# EAGLE schematic LandingGearSchematic_2 (EAGLE 9.5.1)

## Sheet 1 of 4: Title
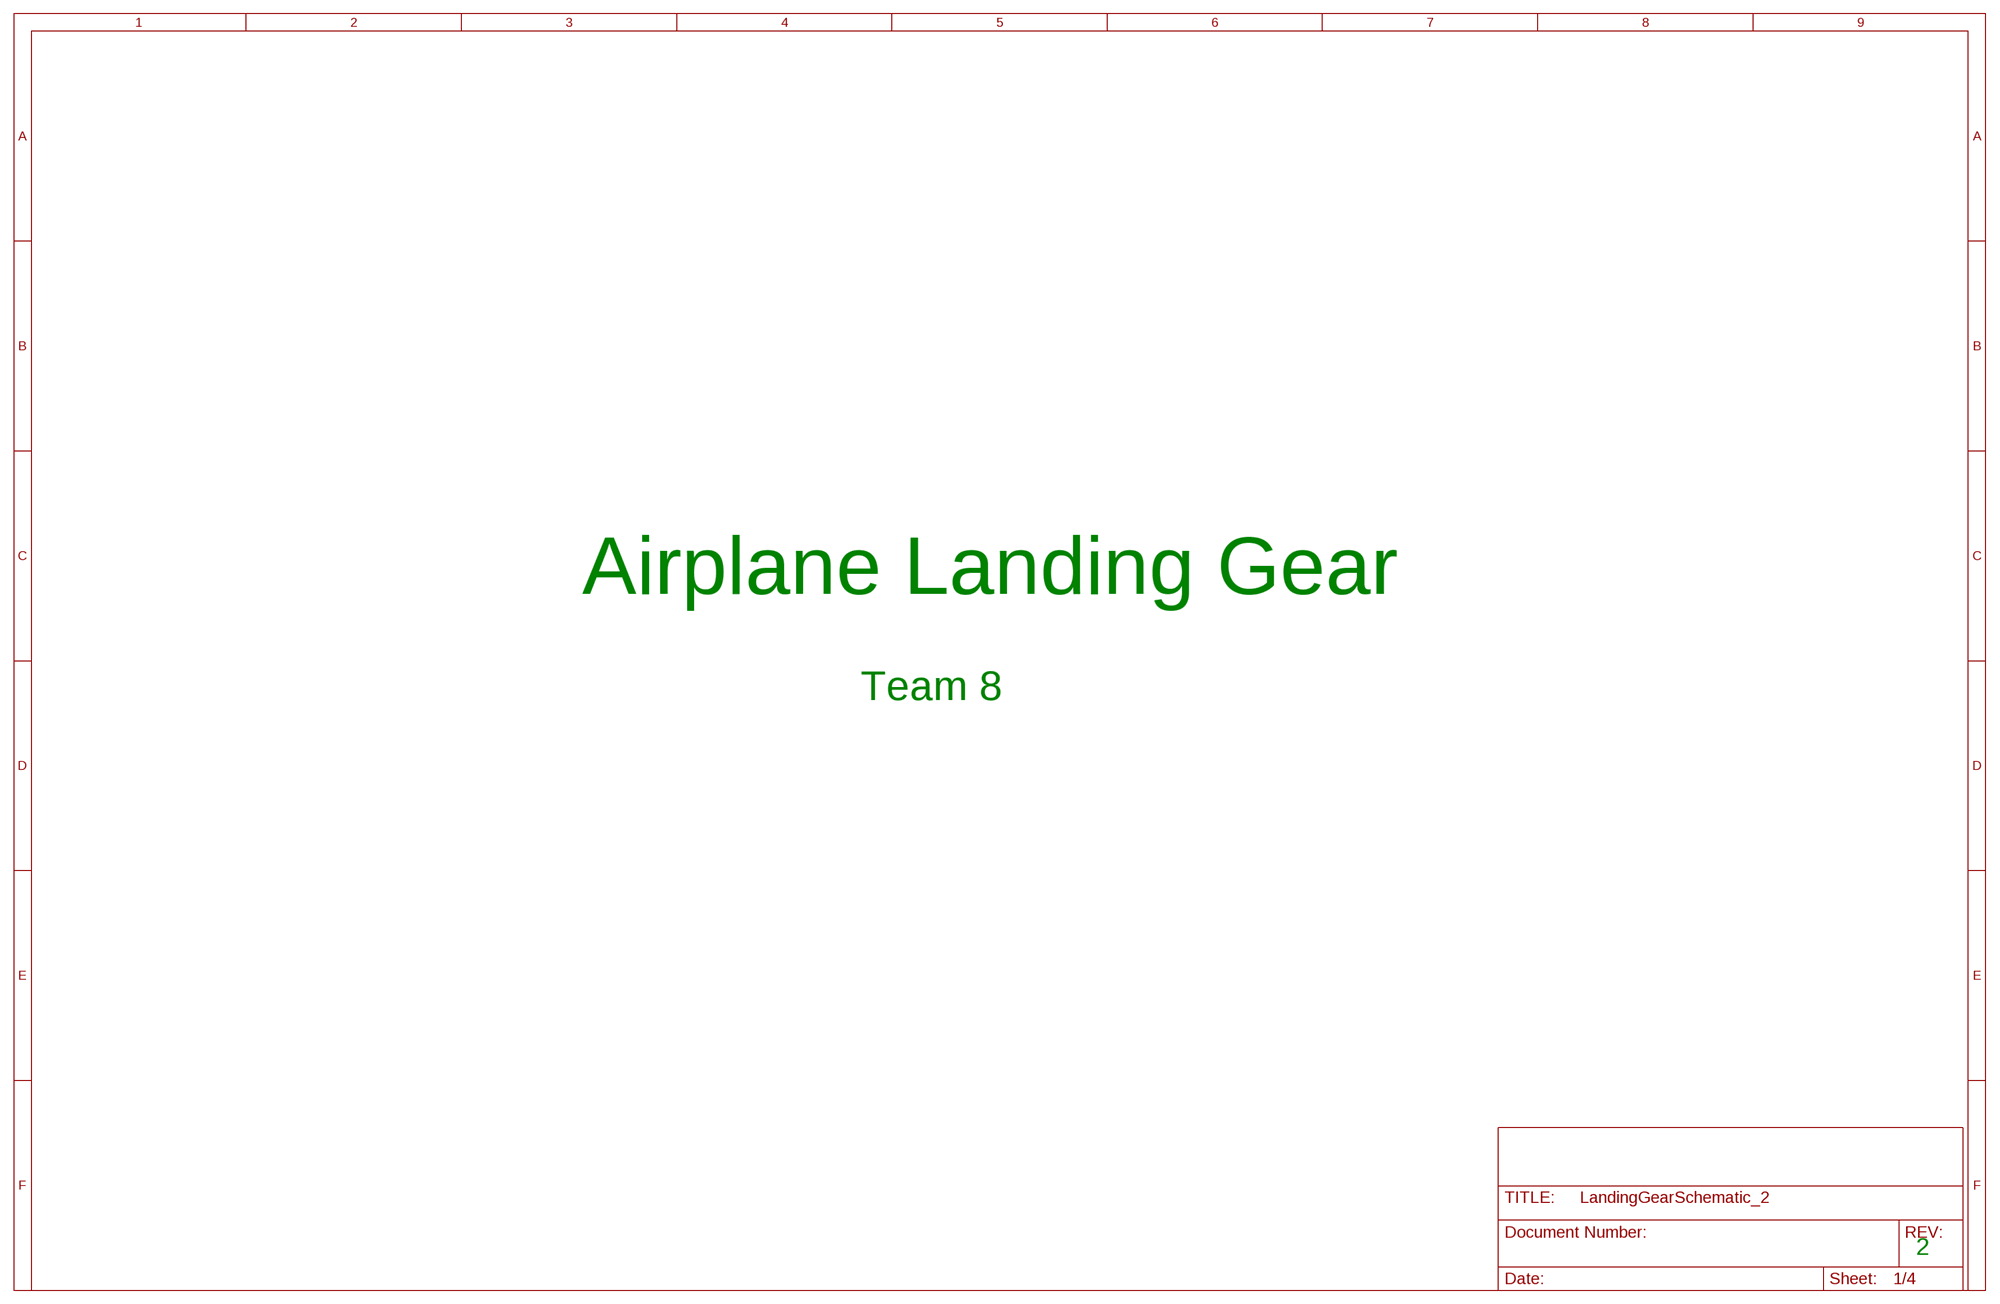
[diagram p0: schematic, sheet 1]

### Notes on the sheet
- Airplane Landing Gear
- Team 8
- 2

## Sheet 2 of 4: Processor(1 of 1)
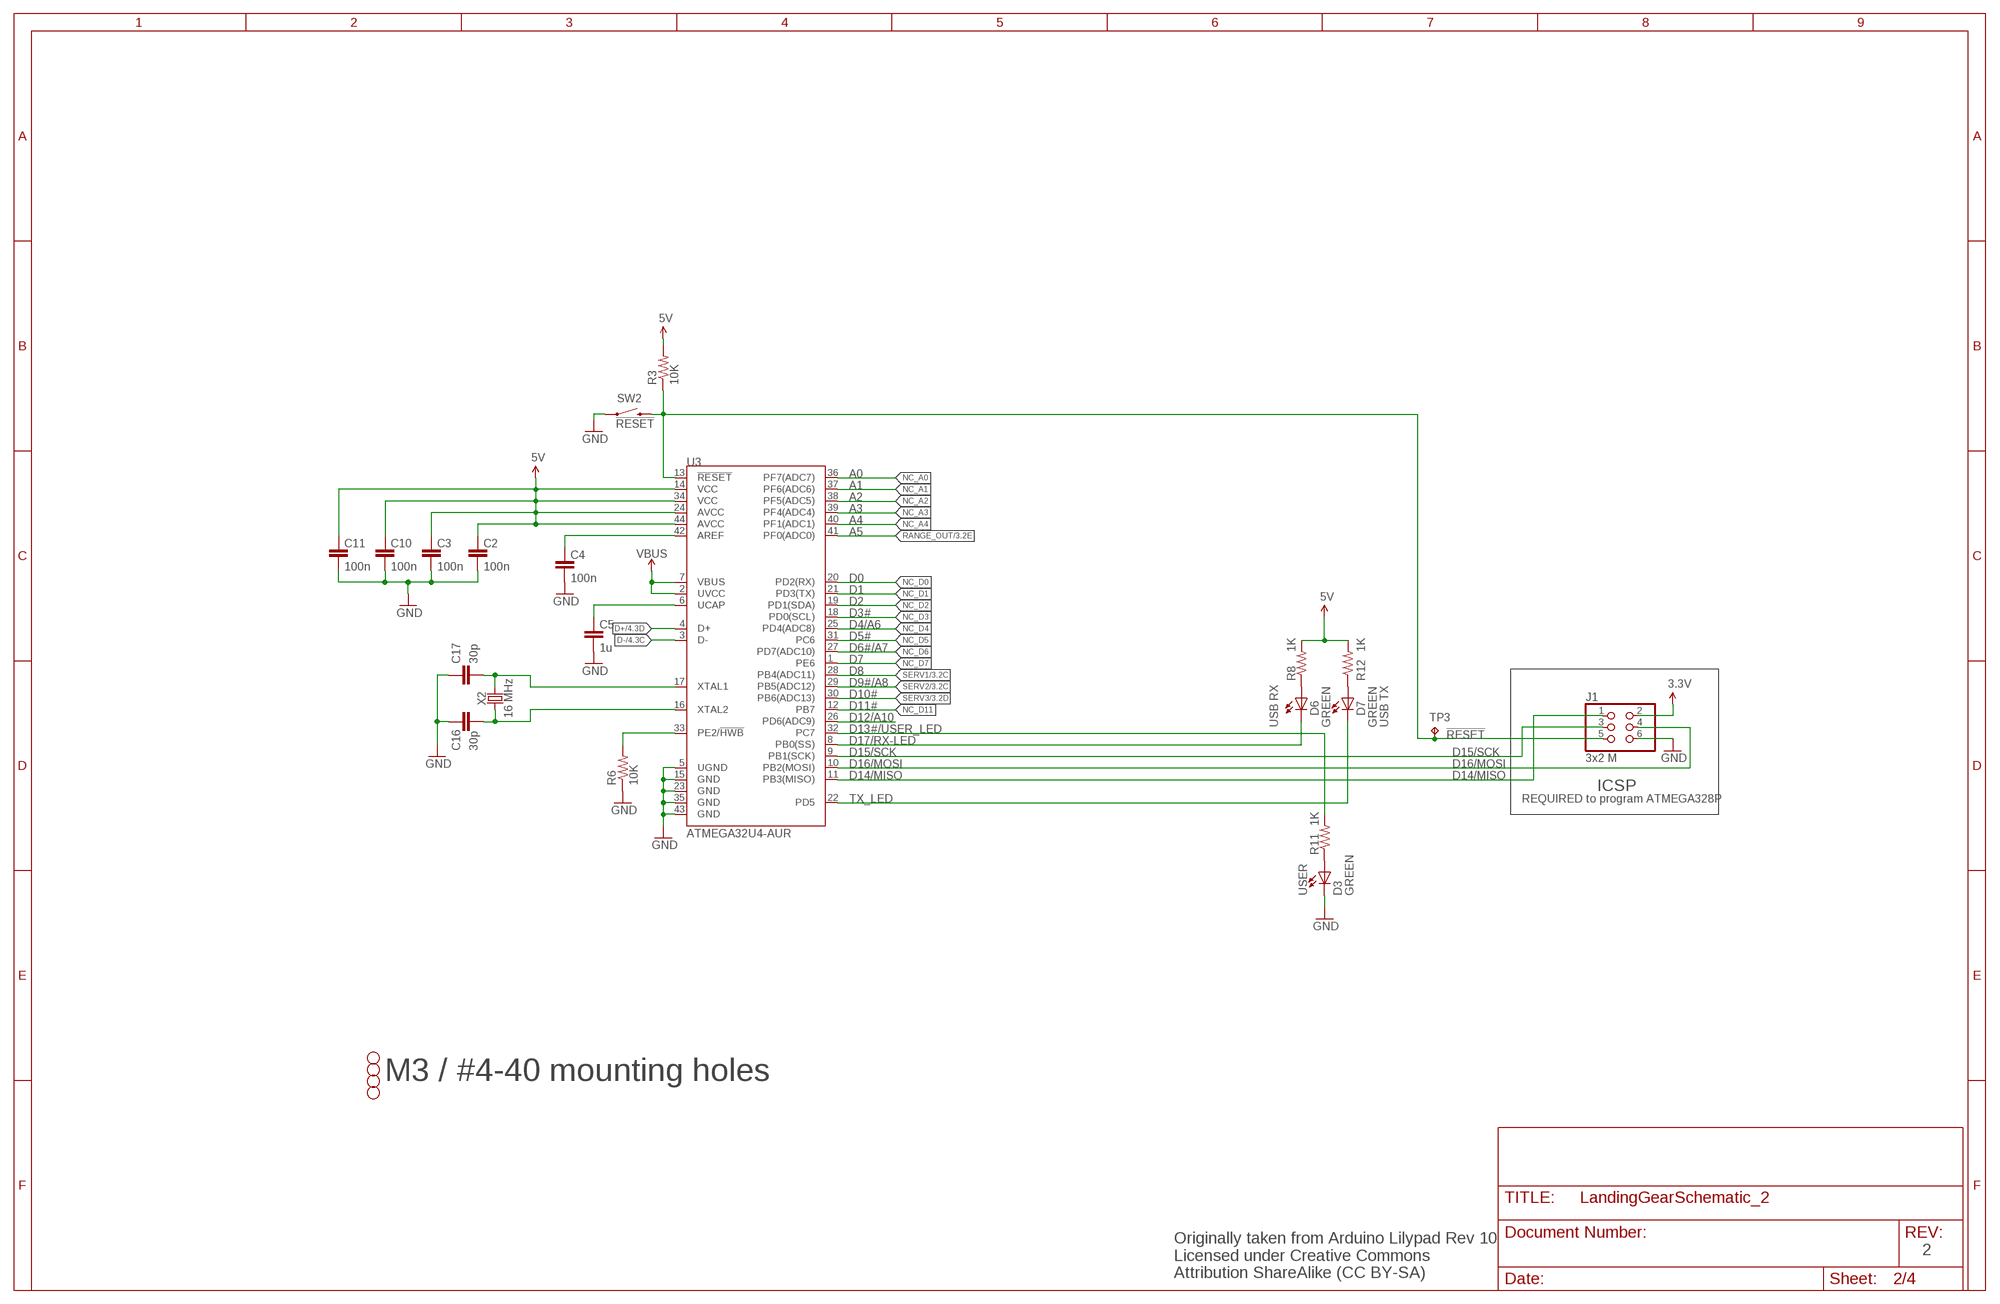
[diagram p1: schematic, sheet 2]

### Parts
C2  100n  C-EUC0805K  [C0805K]
C3  100n  C-EUC0805K  [C0805K]
C4  100n  C-EUC0805K  [C0805K]
C5  1u  C-EUC0805K  [C0805K]
C10  100n  C-EUC0805K  [C0805K]
C11  100n  C-EUC0805K  [C0805K]
C16  30p  C-EUC0805K  [C0805K]
C17  30p  C-EUC0805K  [C0805K]
D3  GREEN  LEDCHIP-LED0805  [CHIP-LED0805]
D6  GREEN  LEDCHIP-LED0805  [CHIP-LED0805]
D7  GREEN  LEDCHIP-LED0805  [CHIP-LED0805]
H1  STAND-OFF  [STAND-OFF]
H2  STAND-OFF  [STAND-OFF]
H3  STAND-OFF  [STAND-OFF]
H4  STAND-OFF  [STAND-OFF]
J1  3x2 M  PINHD-2X3  [2X03]
R3  10K  R-US_R0805  [R0805]
R6  10K  R-US_R0805  [R0805]
R8  1K  R-US_R0805  [R0805]
R11  1K  R-US_R0805  [R0805]
R12  1K  R-US_R0805  [R0805]
SW2  !RESET  SWITCH-MOMENTARY-2SMD  [TACTILE_SWITCH_SMD]
TP3  TPPAD1-13  [P1-13]
U3  ATMEGA32U4-AUR  ATMEGA32U4TQFP-44  [TQFP44]
X2  16 MHz  CRYSTALSMD-HC49UP  [HC49UP]

### Nets
3.3V: C2.1 C3.1 C10.1 C11.1 J1.2 R3.2 R8.2 R12.2 U3.14(VCC) U3.24(AVCC) U3.34(VCC) U3.44(AVCC) ; supply symbol labelled 5V ; also sheet 4
!RESET: J1.5 R3.1 SW2.3 TP3.TP U3.13(!RESET)
AREF: C4.1 U3.42(AREF)
D13#/USER_LED: R11.2 U3.32(PC7)
D14/MISO: J1.1 U3.11(PB3(MISO))
D15/SCK: J1.3 U3.9(PB1(SCK))
D16/MOSI: J1.4 U3.10(PB2(MOSI))
D17/RX-LED: D6.C U3.8(PB0(SS))
D+: U3.4(D+) ; also sheet 4
D-: U3.3(D-) ; also sheet 4
GND: C2.2 C3.2 C4.2 C5.2 C10.2 C11.2 C16.2 C17.2 D3.C J1.6 R6.1 SW2.1 U3.5(UGND) U3.15(GND) U3.23(GND) U3.35(GND) U3.43(GND) ; also sheet 3,4
N$13: D3.A R11.1
N$15: D6.A R8.1
N$16: D7.A R12.1
N$28: U3.26(PD6(ADC9))
NC_A0: U3.36(PF7(ADC7))
NC_A1: U3.37(PF6(ADC6))
NC_A2: U3.38(PF5(ADC5))
NC_A3: U3.39(PF4(ADC4))
NC_A4: U3.40(PF1(ADC1))
NC_D0: U3.20(PD2(RX))
NC_D1: U3.21(PD3(TX))
NC_D2: U3.19(PD1(SDA))
NC_D3: U3.18(PD0(SCL))
NC_D4: U3.25(PD4(ADC8))
NC_D5: U3.31(PC6)
NC_D6: U3.27(PD7(ADC10))
NC_D7: U3.1(PE6)
NC_D11: U3.12(PB7)
PE2/!HWB: R6.2 U3.33(PE2/!HWB)
RANGE_OUT: U3.41(PF0(ADC0)) ; also sheet 3
SERV1: U3.28(PB4(ADC11)) ; also sheet 3
SERV2: U3.29(PB5(ADC12)) ; also sheet 3
SERV3: U3.30(PB6(ADC13)) ; also sheet 3
TX_LED: D7.C U3.22(PD5)
UCAP: C5.1 U3.6(UCAP)
VBUS: U3.2(UVCC) U3.7(VBUS) ; also sheet 4
XTAL1: C17.1 U3.17(XTAL1) X2.2
XTAL2: C16.1 U3.16(XTAL2) X2.1

### Notes on the sheet
- A0
- A1
- A2
- A3
- A4
- A5
- D0
- D1
- D2
- D3#
- D4/A6
- D5#
- D6#/A7
- D7
- D8
- D9#/A8
- D10#
- D11#
- D12/A10
- USB RX | USB TX
- ICSP
- REQUIRED to program ATMEGA328P
- USER
- M3 / #4-40 mounting holes
- 2
- Originally taken from Arduino Lilypad Rev 10
  Licensed under Creative Commons 
  Attribution ShareAlike (CC BY-SA)

## Sheet 3 of 4: Headers (1 of 1)
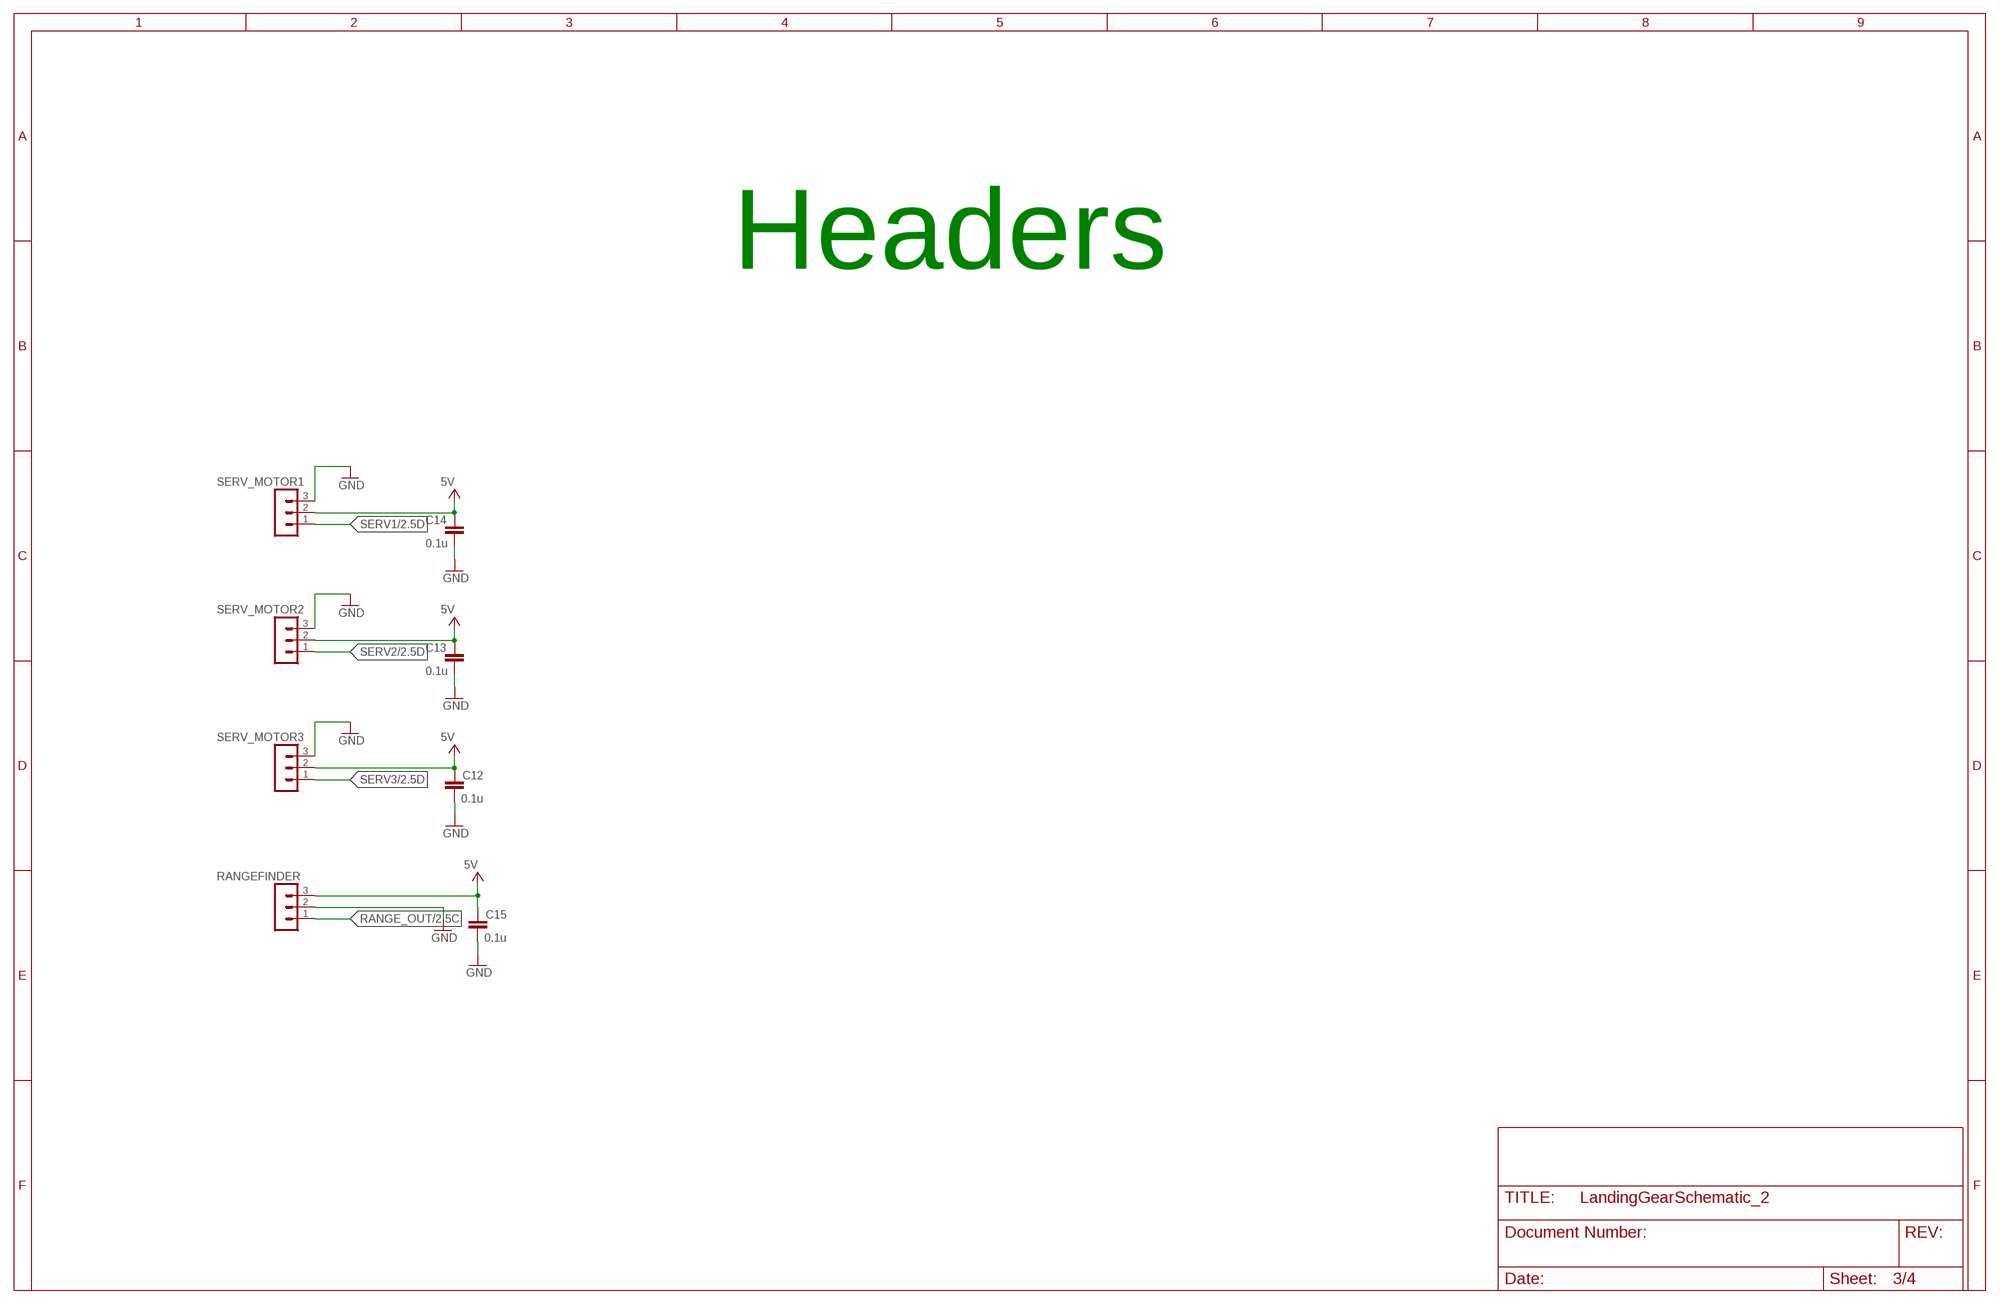
[diagram p2: schematic, sheet 3]

### Parts
C12  0.1u  C-EUC0805K  [C0805K]
C13  0.1u  C-EUC0805K  [C0805K]
C14  0.1u  C-EUC0805K  [C0805K]
C15  0.1u  C-EUC0805K  [C0805K]
RANGEFINDER  MA03-1  [MA03-1]
SERV_MOTOR1  MA03-1  [MA03-1]
SERV_MOTOR2  MA03-1  [MA03-1]
SERV_MOTOR3  MA03-1  [MA03-1]

### Nets
GND: C12.2 C13.2 C14.2 C15.2 RANGEFINDER.2 SERV_MOTOR1.3 SERV_MOTOR2.3 SERV_MOTOR3.3 ; also sheet 2,4
RANGE_OUT: RANGEFINDER.1 ; also sheet 2
SERV1: SERV_MOTOR1.1 ; also sheet 2
SERV2: SERV_MOTOR2.1 ; also sheet 2
SERV3: SERV_MOTOR3.1 ; also sheet 2
VCC [power]: C12.1 C13.1 C14.1 C15.1 RANGEFINDER.3 SERV_MOTOR1.2 SERV_MOTOR2.2 SERV_MOTOR3.2 ; supply symbol labelled 5V

### Notes on the sheet
- Headers

## Sheet 4 of 4: Power (1 of 1)
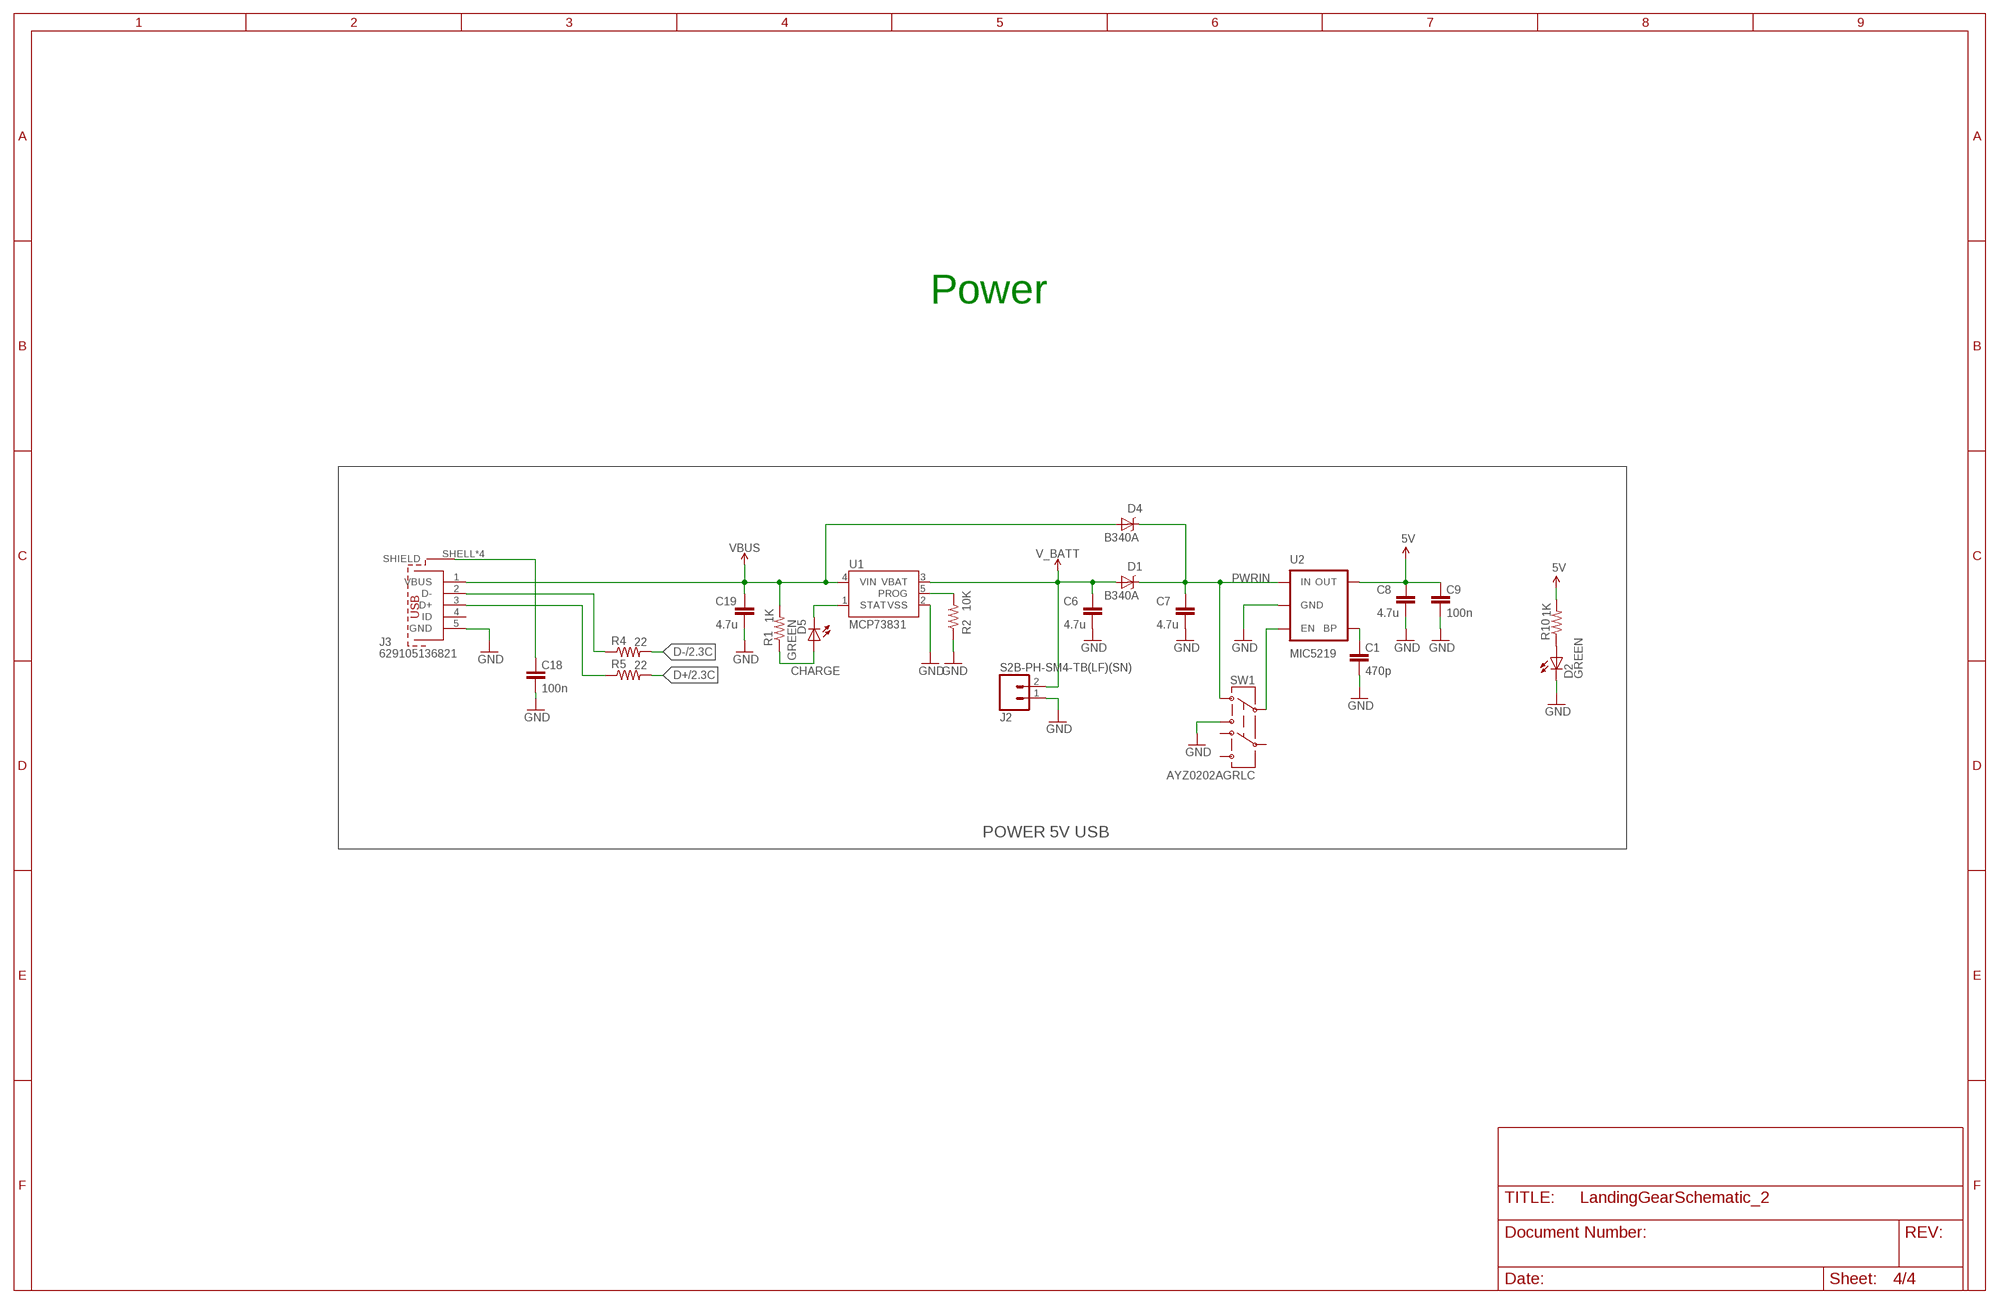
[diagram p3: schematic, sheet 4]

### Parts
C1  470p  C-EUC0805K  [C0805K]
C6  4.7u  C-EUC0805K  [C0805K]
C7  4.7u  C-EUC0805K  [C0805K]
C8  4.7u  C-EUC0805K  [C0805K]
C9  100n  C-EUC0805K  [C0805K]
C18  100n  C-EUC0805K  [C0805K]
C19  4.7u  C-EUC0805K  [C0805K]
D1  B340A  DIODE-SCHOTTKY_  [SMA-DIODE]
D2  GREEN  LEDCHIP-LED0805  [CHIP-LED0805]
D4  B340A  DIODE-SCHOTTKY_  [SMA-DIODE]
D5  GREEN  LEDCHIP-LED0805  [CHIP-LED0805]
J2  S2B-PH-SM4-TB(LF)(SN)  M02-JST-2MM-SMT  [JST-2-SMD]
J3  629105136821  [629105136821]
R1  1K  R-US_R0805  [R0805]
R2  10K  R-US_R0805  [R0805]
R4  22  R-US_R0805  [R0805]
R5  22  R-US_R0805  [R0805]
R10  1K  R-US_R0805  [R0805]
SW1  AYZ0202AGRLC  SWITCH-DPDTSMD  [AYZ0202]
U1  MCP73831  [SOT23-5]
U2  MIC5219  V_REG_MIC5219SMD  [SOT23-5]

### Nets
3.3V: C8.1 C9.1 R10.2 U2.5(OUT) ; supply symbol labelled 5V ; also sheet 2
D+: R5.2 ; also sheet 2
D-: R4.2 ; also sheet 2
GND: C1.2 C6.2 C7.2 C8.2 C9.2 C18.2 C19.2 D2.C J2.1 J3.5(GND) R2.1 SW1.3 U1.2(VSS) U2.2(GND) ; also sheet 2,3
MCPPROG: R2.2 U1.5(PROG)
MIC-BP: C1.1 U2.4(BP)
MIC-EN: SW1.2 U2.3(EN)
N$3: D5.A R1.1
N$4: D5.C U1.1(STAT)
N$7: D2.A R10.1
N$14: C18.1 J3.SHELL1(SHIELD) J3.SHELL2(SHIELD) J3.SHELL3(SHIELD) J3.SHELL(SHIELD)
N$19: J3.2(D-) R4.1
N$20: J3.3(D+) R5.1
PWRIN: C7.1 D1.C D4.C SW1.1 U2.1(IN)
V_BATT: C6.1 D1.A J2.2 U1.3(VBAT)
VBUS: C19.1 D4.A J3.1(VBUS) R1.2 U1.4(VIN) ; also sheet 2
Unconnected: J3.4(ID) SW1.4 SW1.5 SW1.6

### Notes on the sheet
- Power
- CHARGE
- POWER 5V USB

## Library data of the parts
C1 = rcl:C-EU: CAPACITOR, European symbol; DESC: CAP CER 470PF 50V X7R 0805; MFR: Samsung; MPN: CL21B471KBANNNC; SPICEPREFIX: C
C2-C4 C9-C11 C18 = rcl:C-EU: CAPACITOR, European symbol; DESC: CAP CER 0.1UF 50V X7R 0805; MFR: Samsung; MPN: CL21B104KBCNNNC; SPICEPREFIX: C
C5 C12-C15 = rcl:C-EU: CAPACITOR, European symbol; DESC: CAP CER 1UF 16V X7R 0805; MFR: Samsung; MPN: CL21B105KOFNNNG; SPICEPREFIX: C
C6-C8 C19 = rcl:C-EU: CAPACITOR, European symbol; DESC: CAP CER 4.7UF 16V X5R 0805; MFR: Samsung; MPN: CL21A475KOFNNNE; SPICEPREFIX: C
C16 = rcl:C-EU: CAPACITOR, European symbol; DESC: CAP CER 30PF 50V C0G/NP0 0805; MFR: Samsung; MPN: CL21C300JBANNNC; SPICEPREFIX: C
C17 = rcl:C-EU: CAPACITOR, European symbol; DESC: CAP CER 30PF 50V C0G/NP0 0805; MFR: Samsung; MPN: CL21C180JBANNNC; SPICEPREFIX: C
D1 D4 = SparkFun-DiscreteSemi:DIODE-SCHOTTKY: Commonly MBRA140.; DESC: DIODE SCHOTTKY 40V 2A SMA; MFR: Diodes Inc; MPN: B340AE-13
D2 D3 D5-D7 = led:LED: LED OSRAM: - CHIPLED LG R971, LG N971, LY N971, LG Q971, LY Q971, LO R971, LY R971 LH N974, LH R974 LS Q976, LO Q976, LY Q976 LO Q996 - Hyper CHIPLED LW Q18S LB Q993, LB Q99A, LB R99A - SideLED LS A670, LO A670, LY A670, LG A670, LP A670 LB A673, LV A673, LT A673, LW A673 LH A674 LY A675 LS A676, LA A676, LO A676, LY A676, LW A676 LS A679, LY A679, LG A679 - Hyper Micro SIDELED® LS Y876, LA Y876, LO Y876, LY Y876 LT Y87S - SmartLED LW L88C, LW L88S LB L89C, LB L89S, LG L890 LS L89K, LO L89K, LY L89K LS L896, LA L896, LO L896, LY L896 - TOPLED LS T670, LO T670, LY T670, LG T670, LP T670 LSG T670, LSP T670, LSY T670, LOP T670, LYG T670 LG T671, LOG T671, LSG T671 LB T673, LV T673, LT T673, LW T673 LH T674 LS T676, LA T676, LO T676, LY T676, LB T676, LH T676, LSB T676, LW T676 LB T67C, LV T67C, LT T67C, LS T67K, LO T67K, LY T67K, LW E67C LS E67B, LA E67B, LO E67B, LY E67B, LB E67C, LV E67C, LT E67C LW T67C LS T679, LY T679, LG T679 LS T770, LO T770, LY T770, LG T770, LP T770 LB T773, LV T773, LT T773, LW T773 LH T774 LS E675, LA E675, LY E675, LS T675 LS T776, LA T776, LO T776, LY T776, LB T776 LHGB T686 LT T68C, LB T68C - Hyper Mini TOPLED® LB M676 - Mini TOPLED Santana® LG M470 LS M47K, LO M47K, LY M47K Source: http://www.osram.convergy.de LUXEON: - LUMILED® LXK2-PW12-R00, LXK2-PW12-S00, LXK2-PW14-U00, LXK2-PW14-V00 LXK2-PM12-R00, LXK2-PM12-S00, LXK2-PM14-U00 LXK2-PE12-Q00, LXK2-PE12-R00, LXK2-PE12-S00, LXK2-PE14-T00, LXK2-PE14-U00 LXK2-PB12-K00, LXK2-PB12-L00, LXK2-PB12-M00, LXK2-PB14-N00, LXK2-PB14-P00, LXK2-PB14-Q00 LXK2-PR12-L00, LXK2-PR12-M00, LXK2-PR14-Q00, LXK2-PR14-R00 LXK2-PD12-Q00, LXK2-PD12-R00, LXK2-PD12-S00 LXK2-PH12-R00, LXK2-PH12-S00 LXK2-PL12-P00, LXK2-PL12-Q00, LXK2-PL12-R00 Source: www.luxeon.com KINGBRIGHT: KA-3528ASYC Source: www.kingbright.com; DESC: LED GREEN CLEAR 0805 SMD; MFR: Würth Elektronik; MPN: 150080GS75000
H1-H4 = SparkFun-Hardware:STAND-OFF: Stand Off Drill holes for mechanically mounting via screws, standoffs, etc. Note: Use the keepout ring to avoid running the screw head into surrounding components. Variant Overviews STAND-OFF - Mechanical footprint for a #4 phillips button head screw. STAND-OFF-TIGHT - Mechanical footprint for a #4 phillips button head screw, Example SparkFun Products Screw - Phillips Head (1/4", 4-40, 10 pack) <https://www.sparkfun.com/products/10453> (PRT-10453) Screw - Phillips Head (1/2", 4-40, 10 pack) <https://www.sparkfun.com/products/10452> (PRT-10452) Screw - Phillips Head (3/4", 4-40, 10 pack) <https://www.sparkfun.com/products/10451> (PRT-10451) Screw - Phillips Head (1", 4-40, 10 pack) <https://www.sparkfun.com/products/10450> (PRT-10450)
J1 = SmartPrj:PINHD-2X3: PIN HEADER; DESC: CONN HEADER VERT 6POS 2ROW 2.54MM; MFR: Harwin; MPN: M20-9980345
J2 = SparkFun-Connectors:M02: Header 2 Standard 2-pin 0.1" header. Use with straight break away headers (SKU : PRT-00116), right angle break away headers (PRT-00553), swiss pins (PRT-00743), machine pins (PRT-00117), and female headers (PRT-00115). Molex polarized connector foot print use with SKU : PRT-08233 with associated crimp pins and housings.; DESC: CONN HEADER SMD R/A 2POS 2MM; MFR: JST; MPN: S2B-PH-SM4-TB(LF)(SN)
J3 = Wurth_Elektronik_Electromechanic_Input-Output_Connectors_rev19b:629105136821: WR-COM SMT Horizontal 5 Contacts Micro USB Type B,5 pins=>Code : Con_I-O_COM_MicroUSB_629105136821 <http://katalog.we-online.de/media/images/eican/Con_I-O_COM_MicroUSB_629105136821_pf2.jpg> Details see: http://katalog.we-online.de/en/em/COM_MICRO_SMT_TYPE_B_HORIZONTAL/629105136821?m Created 2014-07-09, Karrer Zheng 2014 (C) Würth Elektronik; DESC: CONN RCPT USB2.0 MICRO B SMD R/A; MFR: Wurth; MPN: 629105136821
R1 R8 R10-R12 = rcl:R-US_: RESISTOR, American symbol; DESC: RES SMD 1K OHM 1% 1/8W 0805; MFR: Yageo; MPN: RC0805FR-071KL; SPICEPREFIX: R
R2 R3 R6 = rcl:R-US_: RESISTOR, American symbol; DESC: RES SMD 10K OHM 1% 1/8W 0805; MFR: Yageo; MPN: RC0805FR-0710KL; SPICEPREFIX: R
R4 R5 = rcl:R-US_: RESISTOR, American symbol; DESC: RES SMD 22 OHM 1% 1/8W 0805; MFR: Yageo; MPN: RC0805FR-0722RL; SPICEPREFIX: R
RANGEFINDER SERV_MOTOR1-SERV_MOTOR3 = con-lstb:MA03-1: PIN HEADER; OC_FARNELL: unknown; OC_NEWARK: unknown
SW1 = SparkFun-Electromechanical:SWITCH-DPDT: DPDT Version of the COM-00597; DESC: SWITCH SLIDE DPDT 100MA 12V; MFR: C&K; MPN: AYZ0202AGRLC
SW2 = SparkFun-Electromechanical:SWITCH-MOMENTARY-2: Various NO switches- pushbuttons, reed, etc; DESC: SWITCH TACTILE SPST-NO 0.05A 12V; MFR: C&K; MPN: RS-187R05A2-DS MT RT
TP3 = testpad:TP: Test pad
U1 = SparkFun-PowerIC:MCP73831: Miniature single cell, fully integrated Li-Ion, Li-polymer charge management controller http://ww1.microchip.com/downloads/en/DeviceDoc/21984a.pdf; DESC: IC CONTROLLR LI-ION 4.2V SOT23-5; MFR: Microchip; MPN: MCP73831T-2ACI/OT; PROD_ID: IC-09995
U2 = SparkFun-PowerIC:V_REG_MIC5219: V_REG MIC5219 Standard 500mA LDO voltage regulator in SOT-23 layout. Micrel part MIC5219. BP (by-pass) pin is used to lower output noise with 470pF cap, may be left open.; DESC: IC REG LINEAR 3.3V 500MA SOT23-5; MFR: Microchip; MPN: MIC5219-3.3YM5-TR
U3 = SparkFun-IC-Microcontroller:ATMEGA32U4: Atmel MCU, 32KByte Atmel 44-pin 8-bit Microcontroller with 32KBytes of ISP Flash and USB Controller Datasheet <http://cdn.sparkfun.com/datasheets/Dev/Arduino/Boards/ATMega32U4.pdf> SparkFun Products LilyPad Arduino USB - ATmega32U4 Board <https://www.sparkfun.com/products/12049> (DEV-12049) Pro Micro - 5V/16MHz <https://www.sparkfun.com/products/12640> (DEV-12640) Pro Micro - 3.3V/8MHz <https://www.sparkfun.com/products/12587> (DEV-12587) Fio v3 - ATmega32U4 <https://www.sparkfun.com/products/11520> (DEV-11520) Qduino Mini <https://www.sparkfun.com/products/13614> (DEV-13614) Makey Makey - Standard Kit <https://www.sparkfun.com/products/11511> (WIG-11511) Makey Makey Deluxe Kit <https://www.sparkfun.com/products/11519> (WIG-11519); DESC: IC MCU 8BIT 32KB FLASH 44TQFP; MFR: Microchip; MPN: ATMEGA32U4-AUR; PROD_ID: IC-10828; VALUE: 32U4
X2 = SparkFun-Clocks:CRYSTAL: Crystals (Generic) These are passive quartz crystals, which can be used as a clock source for a microcontroller. Crystal's are two-terminal devices. They require external "load" capacitors to generate an oscillating signal.; DESC: CRYSTAL 16.000 MHZ 18PF SMD; MFR: ECS; MPN: ECS-160-18-5PX-TR

## Net classes
0 default: width 0.254 mm, clearance 0.254 mm
1 power: width 0.61 mm, drill 0.61 mm, clearance 0.254 mm